# Altium schematic sheet Master MCU ICSP Communication.SchDoc: Master MCU ICSP Communication Socket
size A4
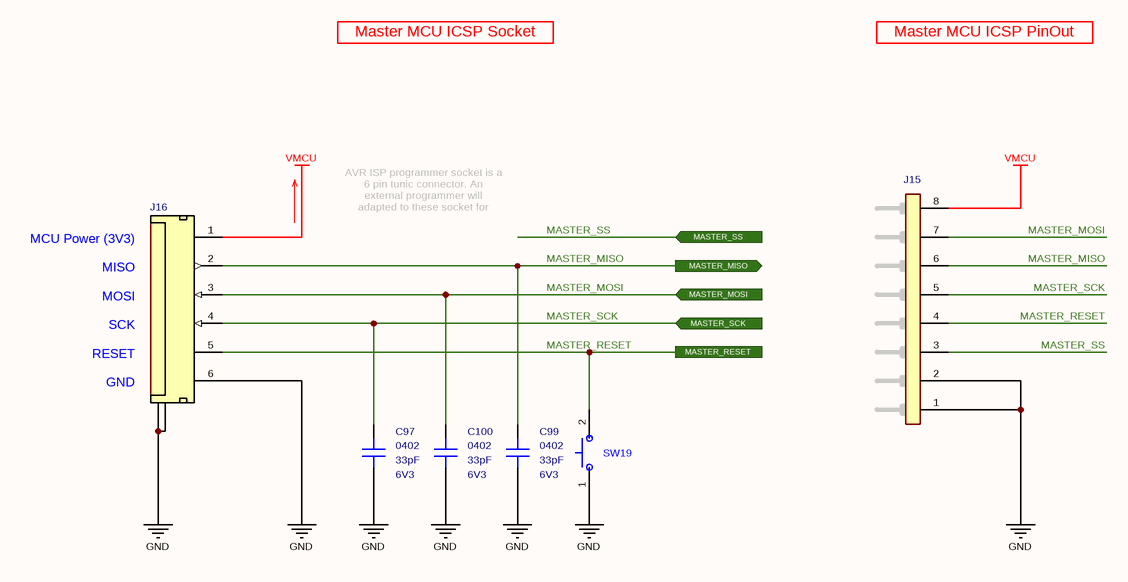
[diagram p0: Master MCU ICSP Communication.SchDoc]

## Parts
C97  value 33pF  Case: 0402  Voltage: 6V3  [CAPACITOR_0402]  (hidden comment: Multilayer Ceramic Capacitor)
C99  value 33pF  Case: 0402  Voltage: 6V3  [CAPACITOR_0402]  (hidden comment: Multilayer Ceramic Capacitor)
C100  value 33pF  Case: 0402  Voltage: 6V3  [CAPACITOR_0402]  (hidden comment: Multilayer Ceramic Capacitor)
J15  2.54 mm Pitch 8P Male Connector  [8P Header]  (value not drawn)
J16  6P Tunic Connector  [Connector_Tunic 6P - H]  (value not drawn)
SW19  Tactile Switches  [PTS526_Switch]  (value not drawn)

## Ports
MASTER_MISO (out), MASTER_MOSI (in), MASTER_RESET, MASTER_SCK (in), MASTER_SS (in)

## Nets
GND: C97.2 C99.2 C100.2 J15.1(Pin-1) J15.2(Pin-2) J16.6(M_DRV) J16.7(GND) J16.8(GND) SW19.1(NC)
VMCU: J15.8(Pin-8) J16.1(VBAT)
MASTER_MISO: C99.1 J15.6(Pin-6) J16.2(M_DRV) ; port MASTER_MISO
MASTER_MOSI: C100.1 J15.7(Pin-7) J16.3(M_DRV) ; port MASTER_MOSI
MASTER_RESET: J15.4(Pin-4) J16.5(M_DRV) SW19.2(COM) ; port MASTER_RESET
MASTER_SCK: C97.1 J15.5(Pin-5) J16.4(M_DRV) ; port MASTER_SCK
MASTER_SS: J15.3(Pin-3) ; port MASTER_SS

## Notes on the sheet
- Master MCU ICSP Socket
- Master MCU ICSP PinOut
- AVR ISP programmer socket is a 6 pin tunic connector. An external programmer will adapted to these socket for programming MCU.
- (near J16) MCU Power (3V3)
  MISO
  MOSI
  SCK
  RESET
  GND
- Title
- Size:
- Date:
- A4
- Number:
- Time:
- Revision:
- Sheet
- of
- File:

## Library data of the parts
C97 C99 C100 = Capacitor - 33pF [0402-6V3]: Capacitor - 33pF [0402] (Ceramic); Manufacturer_Name: Kemet; Manufacturer_Part_Number: C0402C330J9RACAUTO; Dielectric: X7R; Tolerance: 10%; Height: 0.5mm; Mouser_Part_Number: 80-C0402C330J9RAUTO; Maximum Operating Temperature: +125; Minimum Operating Temperature: -55; ROHS: Yes; ComponentLink1Description: DataSheet; ComponentLink1URL: https://api.kemet.com/component-edge/download/datasheet/C0402C330J9RACAUTO.pdf; ComponentLink2Description: Mouser; ComponentLink2URL: https://www.mouser.com/Search/Refine.aspx?Keyword=80-C0402C330J9RAUTO; Supplier 1: Mouser; Supplier Part Number 1: 80-C0402C330J9RAUTO
J15 = Connector - Male Header 8P (2.54): Headers & Wire Housings BREAKAWAY HDR VERT 8; Manufacturer Name: Molex; Position: 8; Row: 1; Pitch: 2.54 mm; Manufacturer Part Number: 22-28-4083; Mouser Part Number: 538-22-28-4083; ROHS: Yes; ComponentLink1Description: DataSheet; ComponentLink1URL: https://www.mouser.com.tr/datasheet/2/276/0022284063_PCB_HEADERS-228265.pdf; ComponentLink2Description: Mouser; ComponentLink2URL: https://www.mouser.com.tr/ProductDetail/Molex/22-28-4083/?qs=%2Fha2pyFaduguMWEp6M%252Bj0x6fHxUvnRGD%252BIxBoa6MO5w%3D
J16 = Connector - Mini Tunic 6P (1.25): Mini Tunic Connector with 6P; Manufacturer_Name: Molex; Manufacturer_Part_Number: 53261-0671; ROHS: Yes; Supplier 1: Avnet; Supplier 2: Mouser; Supplier 3: Arrow; Supplier 4: Farnell; Supplier 5: Newark; Supplier 6: Digi-Key; Supplier Part Number 1: 0532610671; Supplier Part Number 2: 538-53261-0671; Supplier Part Number 3: 53261-0671; Supplier Part Number 4: 1125375; Supplier Part Number 5: 93K4246; Supplier Part Number 6: WM7624CT-ND; System: Connector
SW19 = Switch - Tactile: Tactile Switches 50mA 12VDC, 5.2x5.2mm, 0.8mm H, 260gf, G leads.; Manufacturer Name: C&K Switches; Manufacturer Part Number: PTS526 SK08 SMTR2 LFS; Height: 0.8mm; Mouser Part Number: 611-PTS526SK08SMTR2L; ComponentLink1Description: DataSheet; ComponentLink1URL: https://eu.mouser.com/datasheet/2/60/pts526-1651200.pdf; ComponentLink2Description: Mouser; ComponentLink2URL: https://eu.mouser.com/ProductDetail/CK/PTS526-SK08-SMTR2-LFS?qs=sGAEpiMZZMsgGjVA3toVBL%2FRce%252ByN3s1hQPqiLlQ%252BeM%3D; Supplier 1: Future Electronics; Supplier 2: Mouser; Supplier 3: Arrow; Supplier 4: Digi-Key; Supplier Part Number 1: PTS526SK08SMTR2LFS-REEL; Supplier Part Number 2: 611-PTS526SK08SMTR2L; Supplier Part Number 3: PTS526 SK08 SMTR2 LFS; Supplier Part Number 4: CKN12219-1-ND